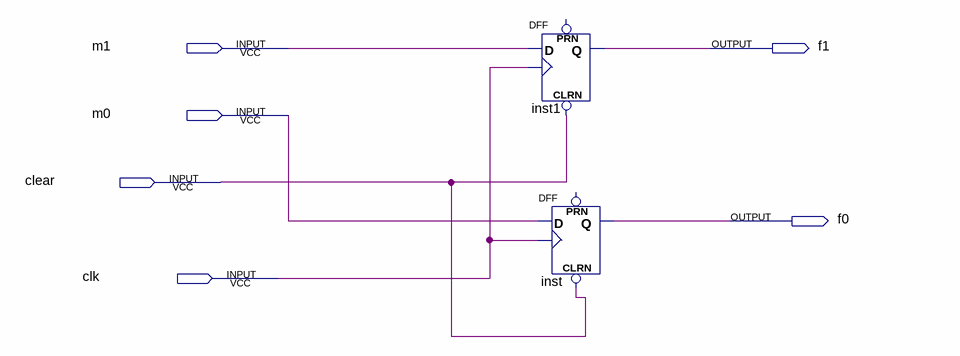
[diagram p0: schematic sheet]
// Quartus schematic FSM.bdf as structural Verilog: 2 symbols, 6 pins
module FSM (
  input  m1,
  input  m0,
  input  clear,
  input  clk,
  output f1,
  output f0
);

  DFF inst1 (.CLRN(clear), .CLK(clk), .D(m1), .Q(f1));  // open: PRN
  DFF inst (.CLRN(clear), .CLK(clk), .D(m0), .Q(f0));  // open: PRN
endmodule
